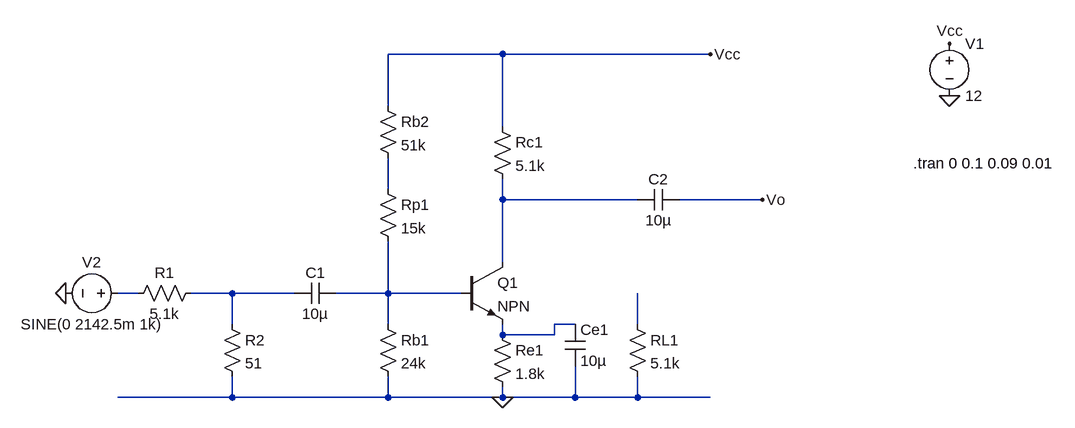
[diagram p0: schematic Experiment2_2_1.asc]
Experiment2_2_1.asc, the LTspice schematic file:
Version 4.1
SHEET 1 1048 680
WIRE 160 -16 -16 -16
WIRE 480 -16 160 -16
WIRE -16 64 -16 -16
WIRE 160 96 160 -16
WIRE -16 192 -16 144
WIRE 160 208 160 176
WIRE 368 208 160 208
WIRE 560 208 432 208
WIRE 160 304 160 208
WIRE -400 352 -432 352
WIRE -256 352 -320 352
WIRE -160 352 -256 352
WIRE -16 352 -16 272
WIRE -16 352 -96 352
WIRE 96 352 -16 352
WIRE -256 400 -256 352
WIRE -16 400 -16 352
WIRE 272 400 240 400
WIRE 368 400 368 352
WIRE 160 416 160 400
WIRE 240 416 240 400
WIRE 240 416 160 416
WIRE -256 512 -256 480
WIRE -256 512 -432 512
WIRE -16 512 -16 480
WIRE -16 512 -256 512
WIRE 160 512 160 496
WIRE 160 512 -16 512
WIRE 272 512 272 464
WIRE 272 512 160 512
WIRE 368 512 368 480
WIRE 368 512 272 512
WIRE 480 512 368 512
FLAG 160 512 0
FLAG 480 -16 Vcc
FLAG 848 -32 Vcc
FLAG 848 48 0
FLAG 560 208 Vo
FLAG -512 352 0
SYMBOL res -304 336 R90
WINDOW 0 0 56 VBottom 2
WINDOW 3 32 56 VTop 2
SYMATTR InstName R1
SYMATTR Value 5.1k
SYMBOL res -272 384 R0
SYMATTR InstName R2
SYMATTR Value 51
SYMBOL res -32 384 R0
SYMATTR InstName Rb1
SYMATTR Value 24k
SYMBOL res -32 176 R0
SYMATTR InstName Rp1
SYMATTR Value 15k
SYMBOL res -32 48 R0
SYMATTR InstName Rb2
SYMATTR Value 51k
SYMBOL npn 96 304 R0
SYMATTR InstName Q1
SYMBOL res 144 400 R0
SYMATTR InstName Re1
SYMATTR Value 1.8k
SYMBOL res 352 384 R0
SYMATTR InstName RL1
SYMATTR Value 5.1k
SYMBOL res 144 80 R0
SYMATTR InstName Rc1
SYMATTR Value 5.1k
SYMBOL voltage 848 -48 R0
WINDOW 123 0 0 Left 0
WINDOW 39 0 0 Left 0
SYMATTR InstName V1
SYMATTR Value 12
SYMBOL cap -96 336 R90
WINDOW 0 0 32 VBottom 2
WINDOW 3 32 32 VTop 2
SYMATTR InstName C1
SYMATTR Value 10µ
SYMATTR SpiceLine V=6.3 Irms=0 Rser=4 Lser=0 mfg="AVX" pn="TAJA106M006" type="Tantalum"
SYMBOL cap 368 224 R270
WINDOW 0 32 32 VTop 2
WINDOW 3 0 32 VBottom 2
SYMATTR InstName C2
SYMATTR Value 10µ
SYMATTR SpiceLine V=6.3 Irms=0 Rser=4 Lser=0 mfg="AVX" pn="TAJA106M006" type="Tantalum"
SYMBOL cap 256 400 R0
SYMATTR Value 10µ
SYMATTR InstName Ce1
SYMATTR SpiceLine V=6.3 Irms=0 Rser=4 Lser=0 mfg="AVX" pn="TAJA106M006" type="Tantalum"
SYMBOL voltage -416 352 R90
WINDOW 0 -32 56 VBottom 2
WINDOW 3 32 56 VTop 2
WINDOW 123 0 0 Left 0
WINDOW 39 0 0 Left 0
SYMATTR InstName V2
SYMATTR Value SINE(0 2142.5m 1k)
TEXT 792 152 Left 2 !.tran 0 0.1 0.09 0.01

The netlist it stands for:
* Experiment2_2_1.asc
R1 N004 N003 5.1k
R2 N004 0 51
Rb1 N005 0 24k
Rp1 N001 N005 15k
Rb2 Vcc N001 51k
Q1 N002 N005 N006 0 NPN
Re1 N006 0 1.8k
RL1 N007 0 5.1k
Rc1 Vcc N002 5.1k
V1 Vcc 0 12
C1 N005 N004 10µ V=6.3 Irms=0 Rser=4 Lser=0 mfg="AVX" pn="TAJA106M006" type="Tantalum"
C2 N002 Vo 10µ V=6.3 Irms=0 Rser=4 Lser=0 mfg="AVX" pn="TAJA106M006" type="Tantalum"
Ce1 N006 0 10µ V=6.3 Irms=0 Rser=4 Lser=0 mfg="AVX" pn="TAJA106M006" type="Tantalum"
V2 N003 0 SINE(0 2142.5m 1k)
.model NPN NPN
.model PNP PNP
.lib standard.bjt
.tran 0 0.1 0.09 0.01
.backanno
.end